# Altium schematic sheet Sheet1.SchDoc
size A4
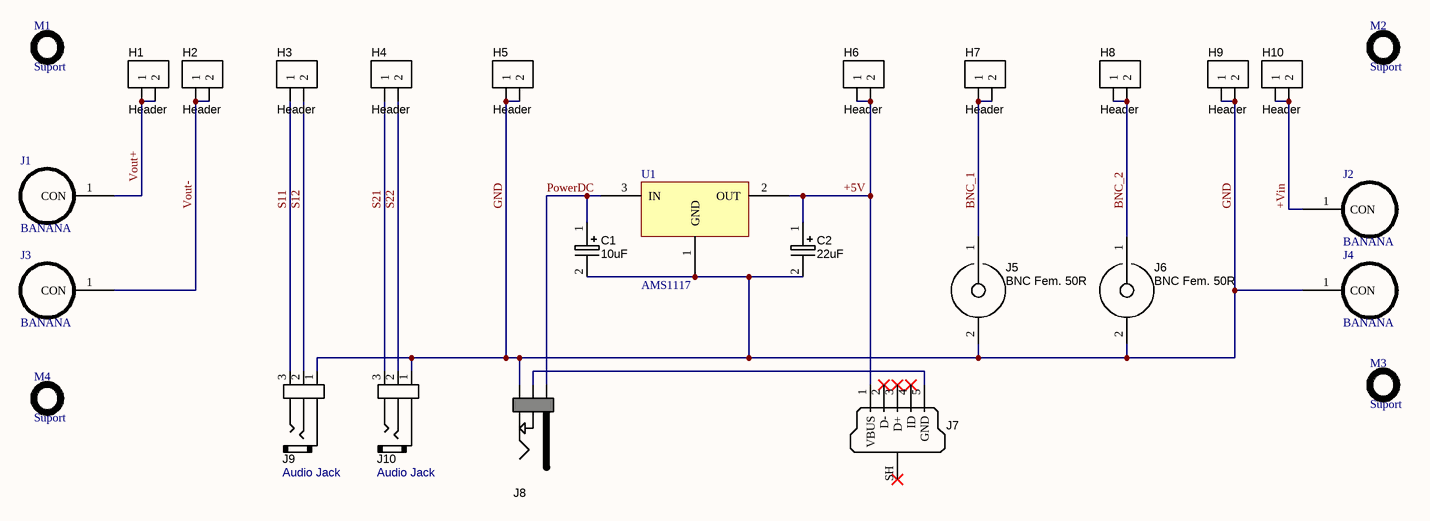
[diagram p0: Sheet1.SchDoc]

## Parts
C1  10uF  [Capacitor_E]
C2  22uF  [Capacitor_E]
H1  Header  [HDR1X2]  (no BOM)
H2  Header  [HDR1X2]  (no BOM)
H3  Header  [HDR1X2]  (no BOM)
H4  Header  [HDR1X2]  (no BOM)
H5  Header  [HDR1X2]  (no BOM)
H6  Header  [HDR1X2]  (no BOM)
H7  Header  [HDR1X2]  (no BOM)
H8  Header  [HDR1X2]  (no BOM)
H9  Header  [HDR1X2]  (no BOM)
H10  Header  [HDR1X2]  (no BOM)
J1  BANANA  [Banana]
J2  BANANA  [Banana]
J3  BANANA  [Banana]
J4  BANANA  [Banana]
J5  BNC Fem. 50R  [CONN_BNC]
J6  BNC Fem. 50R  [CONN_BNC]
J7  USB Micro Type B (recommended if hand soldering)  [USB_MICRO-B_v2]  (value not drawn)
J8  CONN_PWR_JACK_2.1x5.5mm  [CONN_PWR_JACK_2.1x5.5mm]  (value not drawn)
J9  Audio Jack  [CONN_AUDIO]
J10  Audio Jack  [CONN_AUDIO]
M1  Suport  [Support]
M2  Suport  [Support]
M3  Suport  [Support]
M4  Suport  [Support]
U1  AMS1117  [SOT223]

## Nets
+5V: C2.1 H6.1 H6.2 J7.1(VBUS) U1.2(OUT)
+Vin: H10.1 H10.2 J2.1(CON)
BNC_1: H7.1 H7.2 J5.1
BNC_2: H8.1 H8.2 J6.1
GND: C1.2 C2.2 H5.1 H5.2 H9.1 H9.2 J4.1(CON) J5.2 J6.2 J8.2 J9.1(Base) J10.1(Base) U1.1(GND)
PowerDC: C1.1 J8.1 U1.3(IN)
S11: H3.1 J9.3(TIP)
S12: H3.2 J9.2(Middle)
S21: H4.1 J10.3(TIP)
S22: H4.2 J10.2(Middle)
Vout+: H1.1 H1.2 J1.1(CON)
Vout-: H2.1 H2.2 J3.1(CON)
NetJ7_5: J7.5(GND) J8.3

Not connected (* = marked no-connect by the designer): J7 2(D-)* 3(D+)* 4(ID)* SH(Shell)*

## Library data of the parts
C1 C2 = CAPE
  C1: Value: 10uF
  C2: Value: 22uF
H1-H10 = Header2P: Header, 2-pin
J1-J4 = BANANA: Female Connector
J5 J6 = CONN_BNC_FEM_50R: Connector BNC 50 Ohm right-angle PCB mounted; Manufacturer 1: TE Connectivity; Manufacturer Part Number 1: 5413515-9; Impedance: 50 Ohm; Ratings: 9400pF; 1500V; SCDType: undef; Category: Connectors; Mounting Type: Through Hole; Supplier 1: Digi-Key; Supplier Part Number 1: A32418-ND; ComponentLink1URL: http://www.te.com/commerce/DocumentDelivery/DDEController?Action=srchrtrv&DocNm=5413515&DocType=Customer+Drawing&DocLang=English; ComponentLink1Description: TE Datasheet
J7 = USB_Micro_TypeB_FCI: Connector SMD-THD USB Micro Type B middle mount; Manufacturer 1: FCI; Manufacturer Part Number 1: 10103593-0001LF; SCDType: undef; Package / Case: SMD/THD mid-mount; Supplier 1: Digi-Key; Supplier Part Number 1: 609-4049-1-ND
J9 J10 = CONN_MINIPHONEJACK: Stereo phone jack mini; Manufacturer 1: CUI Inc; Manufacturer Part Number 1: SJ1-2513-SMT; SCDType: undef; Material: Plastic, metal; Supplier 1: Digi-Key; Supplier Part Number 1: CP1-2513SJCT-ND
U1 = AMS1117: Voltage Regulator